# Altium project DLKU_PPK57_V2.0.PrjPcb
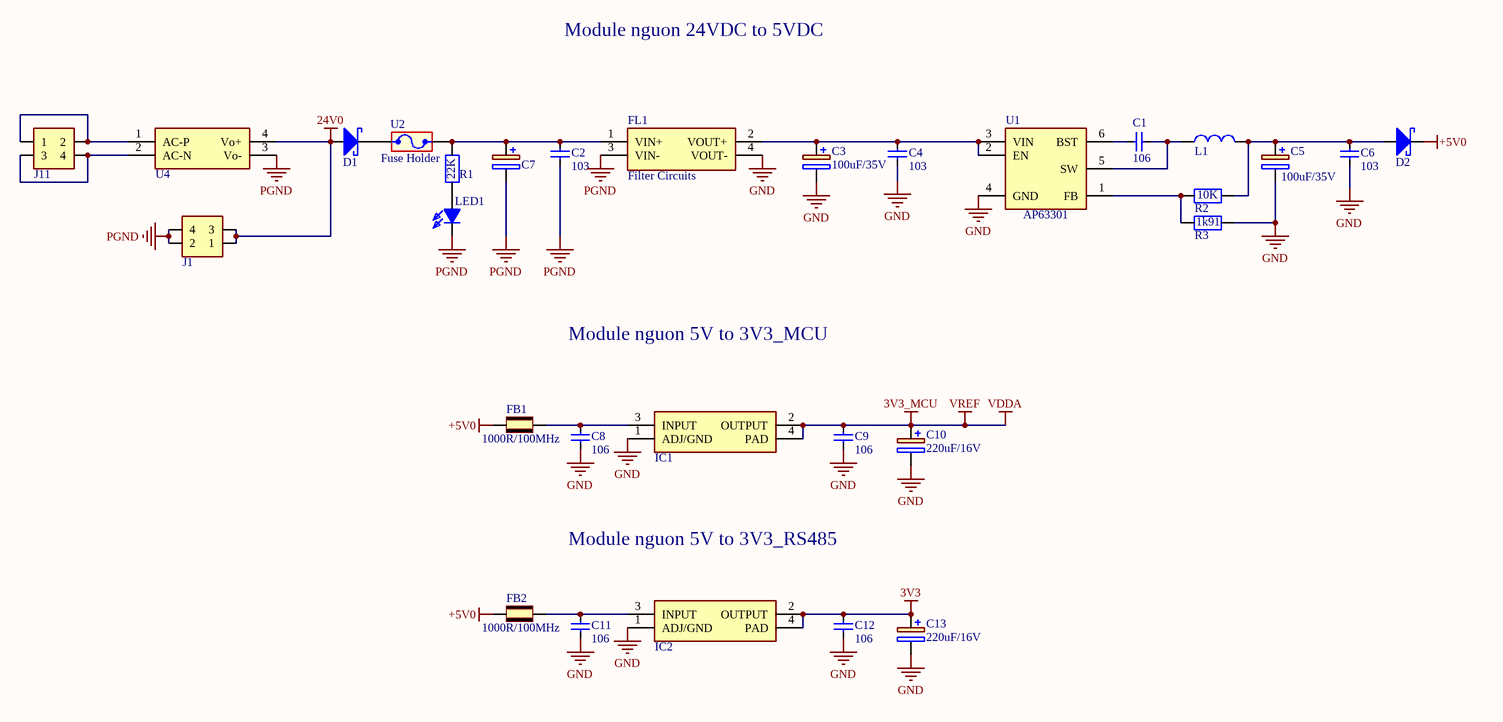
[diagram p0: Power.SchDoc]
3 sheets, 248 parts. Net scope: flat (ports and power ports of the same name join across sheets).
Board file: DLU_PPK57_V2.0.PcbDoc
Sheets:
  Power.SchDoc
  MCU.SchDoc
  Digital In-Out.SchDoc

## Sheet Power.SchDoc
size A2; SheetNumber: 1; SheetTotal: 2

### Parts
C1  106  [CAPC1608X95N]
C2  103  [CAPC1608X95N]
C3  100uF/35V  [CAPAE850X1050N]
C4  103  [CAPC1608X95N]
C5  100uF/35V  [CAPAE850X1050N]
C6  103  [CAPC1608X95N]
C7  330uF/35V  [CAPAE1000X1270N]  (value not drawn)
C8  106  [CAPC1608X95N]
C9  106  [CAPC1608X95N]
C10  220uF/16V  [CAPPM7344X430N]
C11  106  [CAPC1608X95N]
C12  106  [CAPC1608X95N]
C13  220uF/16V  [CAPPM7344X430N]
D1  40V/5A  [SODFL3517X110N]  (value not drawn)
D2  40V/5A  [SODFL3517X110N]  (value not drawn)
FB1  1000R/100MHz  [BEADC2012X110N]
FB2  1000R/100MHz  [BEADC2012X110N]
FL1  Filter Circuits  [BNX024H01K]
IC1  3V3-1A  [SOT230P700X180-4N]  (value not drawn)
IC2  3V3-1A  [SOT230P700X180-4N]  (value not drawn)
J1  Connector THD 4 position 0.165" (4.20mm)  [RHDR4W125P550X420_2X2_960X960X1310P]  (value not drawn)
J11  Connector THD 4 position 0.165" (4.20mm)  [RHDR4W125P550X420_2X2_960X960X1310P]  (value not drawn)
L1  Inductor 4.7uH/2A  [WE-PD2_453255]  (value not drawn)
LED1  LED0603_BLUE  [LEDC1608X80N]  (value not drawn)
R1  22k  [RESC1608X55N]  (value not drawn)
R2  10k  [RESC1608X55N]  (value not drawn)
R3  Res 0603 1k91  [RESC1608X55N]  (value not drawn)
U1  AP63301  [SOT95P280X100-6N]
U2  Fuse Holder  [01550900M]
U4  AC/DC CONVERTER 24V 20W  [HLK-20M24]  (value not drawn)

### Nets
3V3: C12.2 C13.1(+) IC2.2(OUTPUT) IC2.4(PAD)
3V3_MCU: C9.2 C10.1(+) IC1.2(OUTPUT) IC1.4(PAD)  [also labelled VDDA, VREF]
24V0: D1.2(A) J1.1 J1.3 U4.4(Vo+)
+5V0: D2.1(K) FB1.1 FB2.1
GND: C3.2(-) C4.1 C5.2(-) C6.1 C8.1 C9.1 C10.2(-) C11.1 C12.1 C13.2(-) FL1.4(VOUT-) IC1.1(ADJ/GND) IC2.1(ADJ/GND) R3.2 U1.4(GND)
PGND: C2.1 C7.2(-) FL1.3(VIN-) J1.2 J1.4 LED1.1(K) U4.3(Vo-)
NetC1_1: C1.1 U1.6(BST)
NetC1_2: C1.2 L1.1 U1.5(SW)
NetC2_2: C2.2 C7.1(+) FL1.1(VIN+) R1.2 U2.2
NetC3_1: C3.1(+) C4.2 FL1.2(VOUT+) U1.2(EN) U1.3(VIN)
NetC5_1: C5.1(+) C6.2 D2.2(A) L1.2 R2.2
NetC8_2: C8.2 FB1.2 IC1.3(INPUT)
NetC11_2: C11.2 FB2.2 IC2.3(INPUT)
NetD1_1: D1.1(K) U2.1
NetJ11_1: J11.1 J11.2 U4.1(AC-P)
NetJ11_3: J11.3 J11.4 U4.2(AC-N)
NetLED1_2: LED1.2(A) R1.1
NetR2_1: R2.1 R3.1 U1.1(FB)

### Notes on the sheet
- Module nguon 24VDC to 5VDC
- Module nguon 5V to 3V3_MCU
- Module nguon 5V to 3V3_RS485
- (in symbol Res 0603 1k91) 1k91
- (in symbol Res 0603 10k) 10K
- (in symbol Res 0603 22k) 22K

### Library data of the parts
C1 C8 C9 C11 C12 = Cap 106 - 0603: Cap 10uF 10v 0603 SMD 10% X7R Phycomp 10nF Multilayer Ceramic Capacitor (MLCC) 10 V dc +/-10% X7R dielectric Standard max op. temp. +125C; Manufacturer_Name: Murata Electronics; Manufacturer_Part_Number: GRM188D71A106KA73D; Datasheet Link: https://psearch.en.murata.com/capacitor/product/GRM188D71A106KA73%23.html; Height: 0.9mm; Mouser Part Number: 81-GRM188D71A106KA3D; Mouser Price/Stock: https://www.mouser.co.uk/ProductDetail/Murata-Electronics/GRM188D71A106KA73D?qs=FvQ4nYu%252B2He2GIhYKxXmMQ%3D%3D; Arrow Part Number: GRM188D71A106KA73D; Arrow Price/Stock: https://www.arrow.com/en/products/grm188d71a106ka73d/murata-manufacturing?region=nac
C2 C4 C6 = Cap 103 - 0603: Cap 10nF 50v 0603 SMD 10% X7R Phycomp 10nF Multilayer Ceramic Capacitor (MLCC) 50 V dc +/-10% X7R dielectric Standard max op. temp. +125C; Manufacturer_Name: KEMET; Manufacturer_Part_Number: CC0603KRX7R9BB103; Datasheet Link: https://datasheet.datasheetarchive.com/originals/distributors/Datasheets_SAMA/d9f127a4875522309d99aa7dec79633c.pdf; Height: 0.9mm; Mouser Part Number: 603-CC603KRX7R9BB103; Mouser Price/Stock: https://www.mouser.co.uk/ProductDetail/YAGEO/CC0603KRX7R9BB103?qs=AgBp2OyFlx%252BeoRRspw6PJg%3D%3D; Arrow Part Number: CC0603KRX7R9BB103; Arrow Price/Stock: https://www.arrow.com/en/products/cc0603krx7r9bb103/yageo?region=nac
C3 C5 = Cap smd 100uF/35V: Aluminium Electrolytic Capacitors - SMD 100UF 35V 105C 2500H; Manufacturer_Name: Vishay; Manufacturer_Part_Number: MAL215097011E3; Datasheet Link: http://www.vishay.com/docs/28395/150crz.pdf; Height: 10.5mm; Mouser Part Number: 594-MAL215097011E3; Mouser Price/Stock: https://www.mouser.co.uk/ProductDetail/Vishay-BC-Components/MAL215097011E3?qs=qmStTZH4TzmmMfVG5I6TQQ%3D%3D; Arrow Part Number: MAL215097011E3; Arrow Price/Stock: https://www.arrow.com/en/products/mal215097011e3/vishay
C7 = Cap smd 330uF/35V: Aluminum Organic Polymer Capacitors 35Vol 330uF SMD 2KHr ESR=22 mOhms AECQ200; Manufacturer_Name: KEMET; Manufacturer_Part_Number: A768MS337M1VLAS022; Datasheet Link: https://search.kemet.com/component-documentation/download/specsheet/A768MS337M1VLAS022; Height: 12.7mm; Mouser Part Number: 80-A768MS337M1VLAS22; Mouser Price/Stock: https://www.mouser.co.uk/ProductDetail/KEMET/A768MS337M1VLAS022?qs=sPbYRqrBIVliRmrbB6XsUw%3D%3D; Arrow Part Number: A768MS337M1VLAS022; Arrow Price/Stock: https://www.arrow.com/en/products/a768ms337m1vlas022/kemet-corporation?region=nac
C10 C13 = Cap smd 220uF/16V: Tantalum Capacitors - Solid SMD 16V 220uF 10% 2917 Multi-anode; Manufacturer_Name: Kyocera AVX; Manufacturer_Part_Number: TPME227K016R0025; Datasheet Link: http://datasheets.avx.com/TPM.pdf; Height: 4.3mm; Mouser Part Number: 581-TPME227K016R0025; Mouser Price/Stock: https://www.mouser.com/Search/Refine.aspx?Keyword=581-TPME227K016R0025
D1 D2 = Diode 40V/5A: DIODE SCHOTTKY 40V 5A SMA; Manufacturer_Name: Nexperia; Manufacturer_Part_Number: PMEG40T30ERX; Datasheet Link: https://assets.nexperia.com/documents/data-sheet/PMEG40T30ER.pdf; Height: 1.1mm; Mouser Part Number: 771-PMEG40T30ERX; Mouser Price/Stock: https://www.mouser.co.uk/ProductDetail/Nexperia/PMEG40T30ERX?qs=1mbolxNpo8eeG%2Fr5KLvXLA%3D%3D; Arrow Part Number: PMEG40T30ERX; Arrow Price/Stock: https://www.arrow.com/en/products/pmeg40t30erx/nexperia?region=europe
FB1 FB2 = Ferrite Bead 1000R 100MHz: Ferrite Beads 1000ohms 100MHz 1A Monolithic 0805 SMD; Manufacturer_Name: Laird-Signal Integrity Products; Manufacturer_Part_Number: MI0805J102R-10; Datasheet Link: https://www.laird.com/sites/default/files/mi0805j102r-10-datasheet.pdf; Height: 1.1mm
FL1 = Filter: EMI Filter Circuits 10.0 UF 50V 20A; Manufacturer_Name: Murata Electronics; Manufacturer_Part_Number: BNX026H01L; Datasheet Link: https://www.murata.com/en-us/products/productdetail?partno=BNX026H01%23; Height: 3.7mm; Mouser Part Number: 81-BNX026H01L; Mouser Price/Stock: https://www.mouser.co.uk/ProductDetail/Murata-Electronics/BNX026H01L?qs=zU3EaVYbc3y78A%2FfsSIPhQ%3D%3D; Arrow Part Number: BNX026H01L; Arrow Price/Stock: https://www.arrow.com/en/products/bnx026h01l/murata-manufacturing?utm_currency=USD&region=nac
IC1 IC2 = AMS1117-3V3: LDO Voltage Regulators 800MA LDO LINEAR REG A 926-LM1117IMP3.3NOPB; Manufacturer_Name: Texas Instruments; Manufacturer_Part_Number: LM1117IMPX3.3/NOPB; Datasheet Link: http://www.ti.com/lit/ds/symlink/lm1117.pdf; Height: 1.8mm
J1 J11 = Connector 2x2: Connector Header Through Hole 4 position 0.165" (4.20mm); Manufacturer_Name: Molex; Manufacturer_Part_Number: 0039281043; Datasheet Link: https://www.molex.com/pdm_docs/sd/039281043_sd.pdf; Height: 13.1mm; Mouser Part Number: N/A; Mouser Price/Stock: https://www.mouser.co.uk/ProductDetail/Molex/0039281043?qs=PBcRNPEHKsoXjYsIax3FJA%3D%3D; Arrow Part Number: 0039281043; Arrow Price/Stock: https://www.arrow.com/en/products/0039281043/molex?utm_currency=USD&region=nac
L1 = Inductor 4.7uH/2A: Power Inductors - SMD WE-PD2 4532 4.7uH 1.82A .11Ohm; Manufacturer_Name: Wurth Elektronik; Manufacturer_Part_Number: 744773047; Mouser Part Number: 710-744773047; Mouser Price/Stock: https://www.mouser.co.uk/ProductDetail/Wurth-Elektronik/744773047?qs=rS3zZhy2AQMDGJWCDZKEvg%3D%3D
LED1 = LED0603_BLUE: LED; Manufacturer_Name: Wurth Elektronik; Manufacturer_Part_Number: 150060BS75000; Datasheet Link: https://componentsearchengine.com/Datasheets/2/150060BS75000.pdf; Height: 0.8mm; Mouser Part Number: 710-150060BS75000; Mouser Price/Stock: https://www.mouser.co.uk/ProductDetail/Wurth-Elektronik/150060BS75000?qs=LlUlMxKIyB2DLLpXQThavA%3D%3D
R1 = Res 0603 22k: Thick Film Resistors - SMD 22 kOhms 100mW 0603 1%; Manufacturer_Name: Panasonic; Manufacturer_Part_Number: ERJ-UP3J223V; Datasheet Link: https://industrial.panasonic.com/cdbs/www-data/pdf/RDP0000/AOA0000C337.pdf; Height: 0.55mm; Mouser Part Number: 667-ERJ-UP3J223V; Mouser Price/Stock: https://www.mouser.co.uk/ProductDetail/Panasonic/ERJ-UP3J223V?qs=GedFDFLaBXHkpI8RZhFc4A%3D%3D
R2 = Res 0603 10k: Resistor 10 kOhms ±1% 0.1W, 1/10W Chip Resistor 0603 (1608 Metric) Automotive AEC-Q200 Thick Film; Manufacturer_Name: Panasonic; Manufacturer_Part_Number: ERJ-3EKF1002V; Datasheet Link: http://industrial.panasonic.com/cdbs/www-data/pdf/RDA0000/AOA0000C86.pdf; Height: 0.55mm; Mouser Part Number: 667-ERJ-3EKF1002V; Mouser Price/Stock: https://www.mouser.co.uk/ProductDetail/Panasonic/ERJ-3EKF1002V?qs=H7k1u0Mp9JSrGPQ5%2F5COuw%3D%3D; Arrow Part Number: ERJ-3EKF1002V; Arrow Price/Stock: https://www.arrow.com/en/products/erj-3ekf1002v/panasonic?region=europe
R3 = Res 0603 1k91: Thick Film Resistors - SMD 1.91K 1% 1/10W; Manufacturer_Name: Bourns; Manufacturer_Part_Number: CR0603-FX-1911ELF; Datasheet Link: https://www.bourns.com/pdfs/chpreztr.pdf; Height: 0.55mm; Mouser Part Number: 652-CR0603FX-1911ELF; Mouser Price/Stock: https://www.mouser.com/Search/Refine.aspx?Keyword=652-CR0603FX-1911ELF
U1 = AP63301: Switching Voltage Regulators DCDC Conv HV Buck TSOT26 T&R 3K; Manufacturer_Name: Diodes Incorporated; Manufacturer_Part_Number: AP63301WU-7; Datasheet Link: https://www.diodes.com//assets/Datasheets/AP63300-AP63301.pdf; Height: 1mm; Mouser Part Number: 621-AP63301WU-7; Mouser Price/Stock: https://www.mouser.co.uk/ProductDetail/Diodes-Incorporated/AP63301WU-7?qs=bZr6mbWTK5mxozg17S0lNg%3D%3D; Arrow Part Number: AP63301WU-7; Arrow Price/Stock: https://www.arrow.com/en/products/ap63301wu-7/diodes-incorporated?region=nac
U2 = Fuse Holder: Fuse Holder ACS NANO HLDR; Manufacturer_Name: LITTELFUSE; Datasheet Link: http://www.littelfuse.com/~/media/electronics/datasheets/fuses/littelfuse_fuse_154_154t_154l_154tl_datasheet.pdf.pdf; Height: 3.81mm; Manufacturer_Part_Number: 01550900M; Mouser Part Number: 576-01550900M; Mouser Price/Stock: https://www.mouser.co.uk/ProductDetail/Littelfuse/01550900M?qs=DDoybve0rC%252BTXq1hqi5X1g%3D%3D; Arrow Part Number: 01550900M; Arrow Price/Stock: https://www.arrow.com/en/products/01550900m/littelfuse?utm_currency=USD&region=europe
U4 = HLK-20M24: AC/DC CONVERTER 24V 20WEnclosed AC DC Converters 1 Output 24V 830mA 85 ~ 264 VAC, 120 ~ 370 VDC Input

## Sheet MCU.SchDoc
size A2
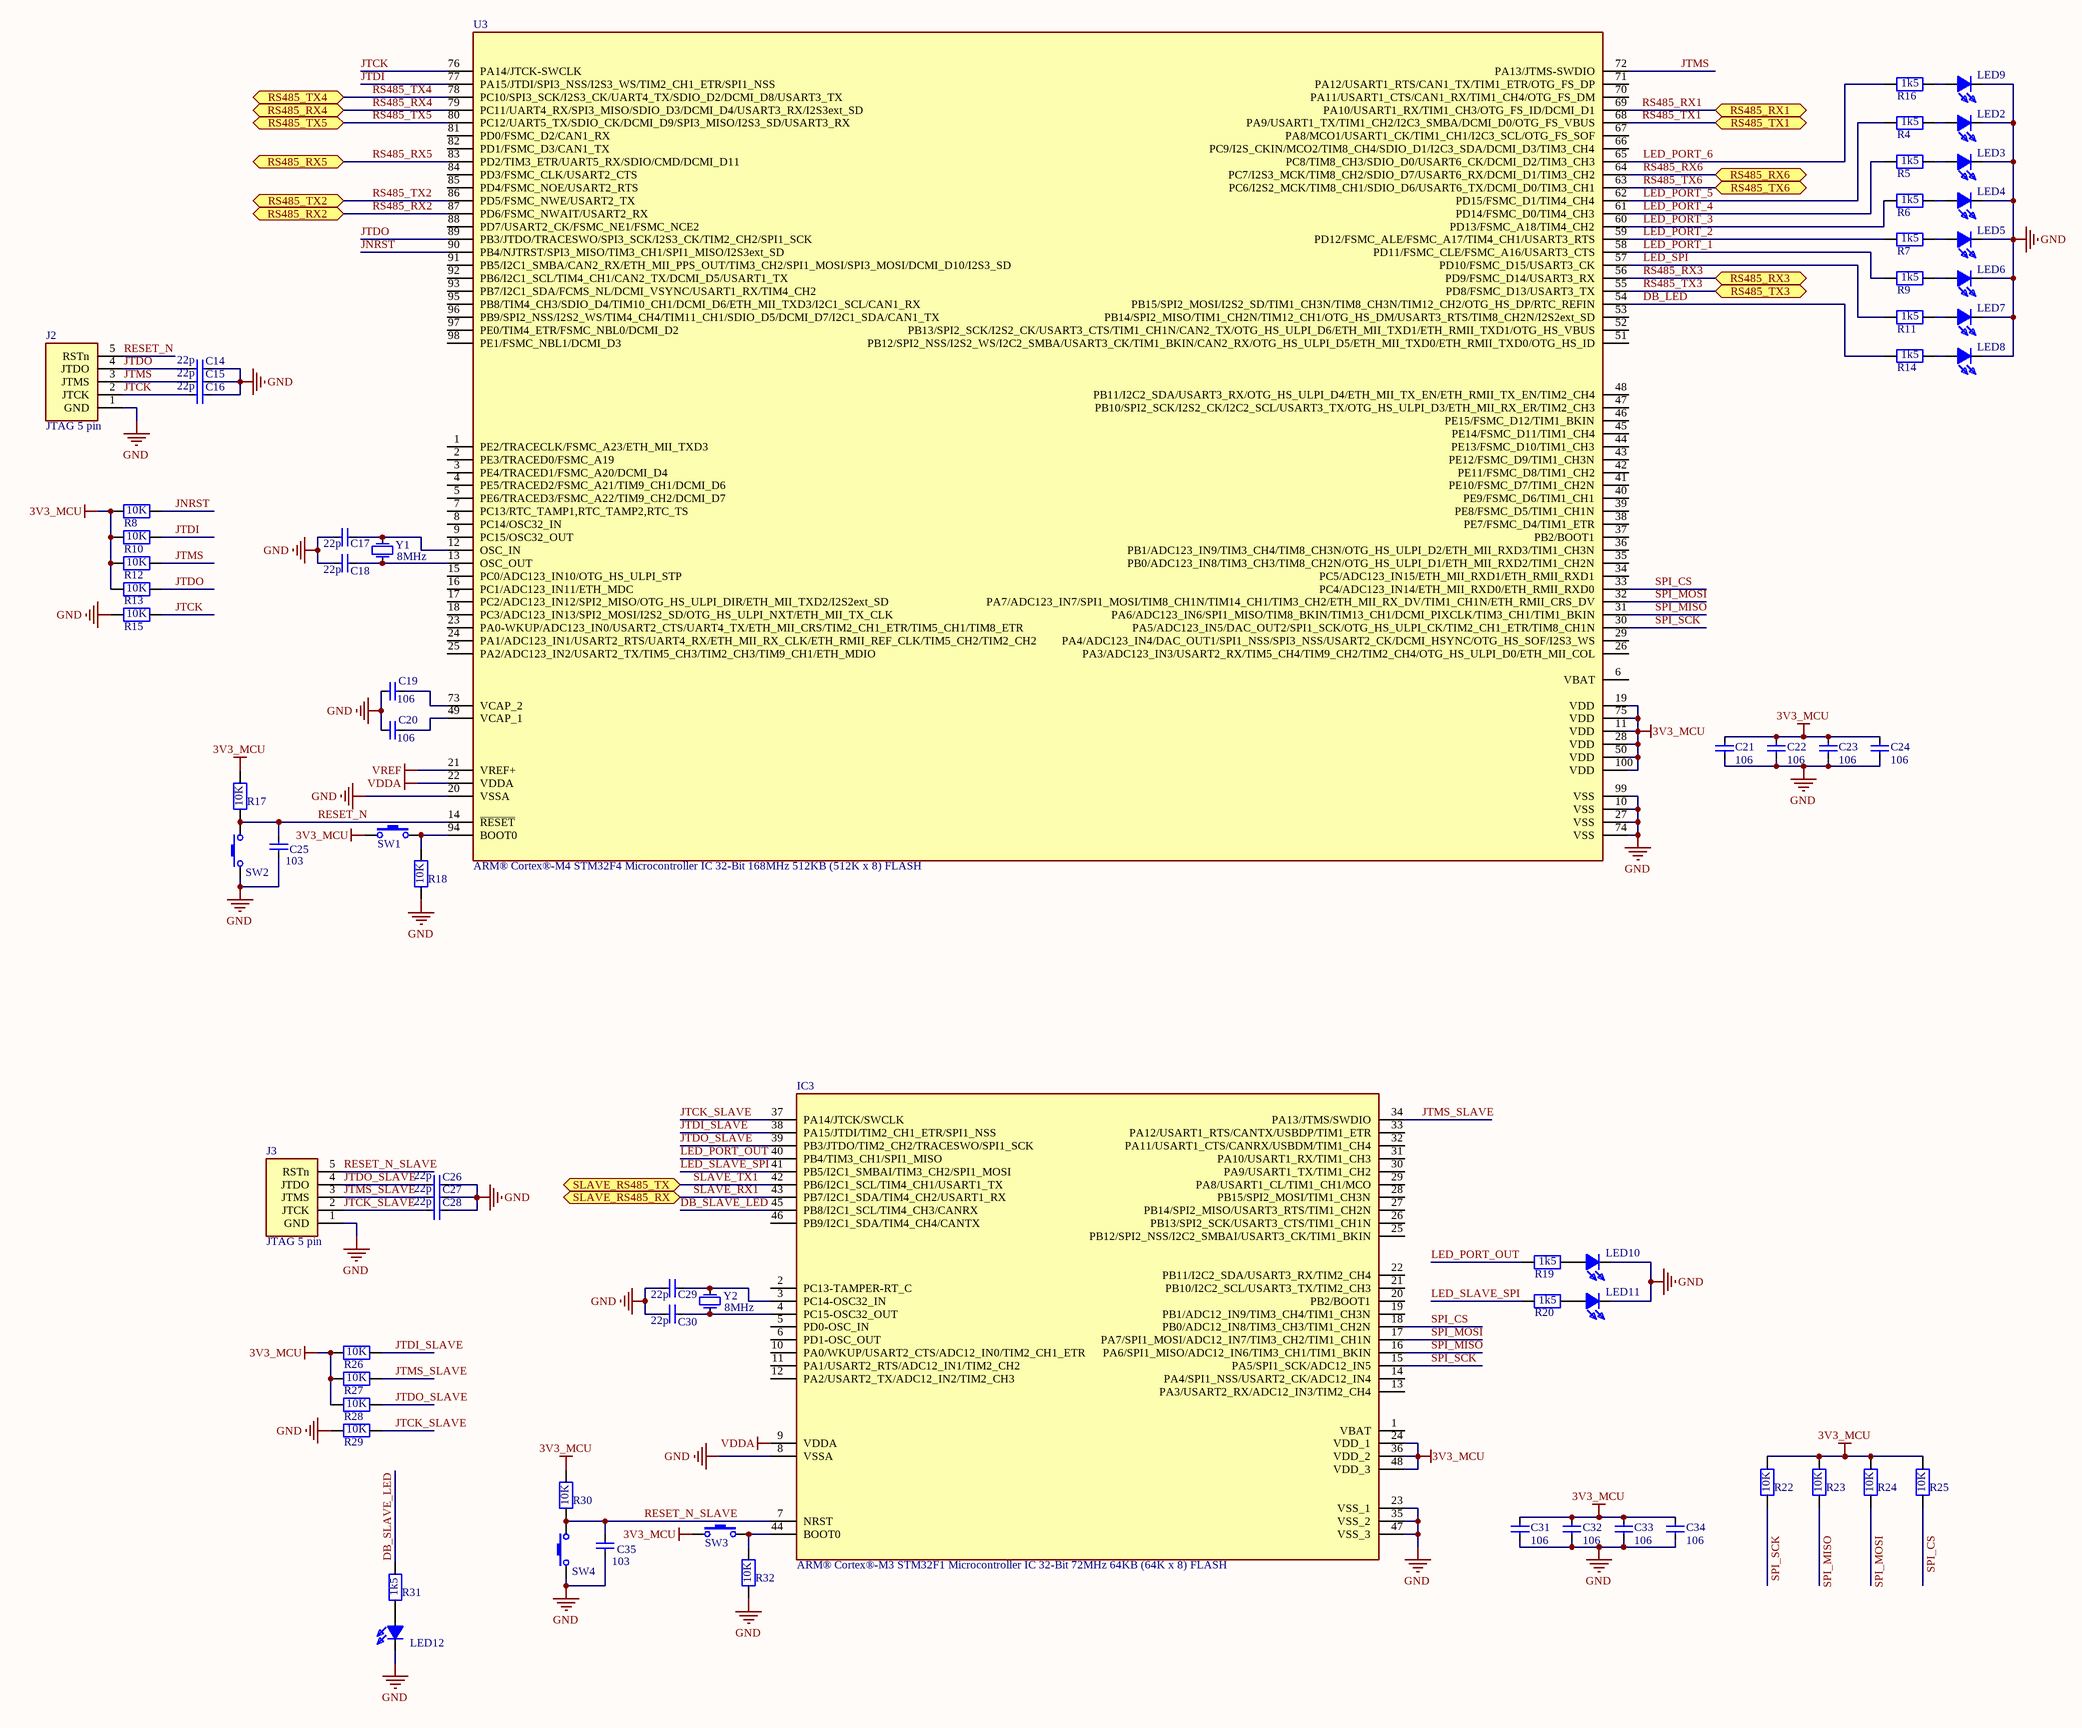
[diagram p1: MCU.SchDoc]

### Parts
C14  22p  [CAPC1608X95N]
C15  22p  [CAPC1608X95N]
C16  22p  [CAPC1608X95N]
C17  22p  [CAPC1608X95N]
C18  22p  [CAPC1608X95N]
C19  106  [CAPC1608X95N]
C20  106  [CAPC1608X95N]
C21  106  [CAPC1608X95N]
C22  106  [CAPC1608X95N]
C23  106  [CAPC1608X95N]
C24  106  [CAPC1608X95N]
C25  103  [CAPC1608X95N]
C26  22p  [CAPC1608X95N]
C27  22p  [CAPC1608X95N]
C28  22p  [CAPC1608X95N]
C29  22p  [CAPC1608X95N]
C30  22p  [CAPC1608X95N]
C31  106  [CAPC1608X95N]
C32  106  [CAPC1608X95N]
C33  106  [CAPC1608X95N]
C34  106  [CAPC1608X95N]
C35  103  [CAPC1608X95N]
IC3  ARM® Cortex®-M3 STM32F1 Microcontroller IC 32-Bit 72MHz 64KB (64K x 8) FLASH  [QFP50P900X900X160-48N]
J2  JTAG 5 pin  [HDRV5W66P0X254_1X5_1270X249X1067P]
J3  JTAG 5 pin  [HDRV5W66P0X254_1X5_1270X249X1067P]
LED2  LED0603_BLUE  [LEDC1608X80N]  (value not drawn)
LED3  LED0603_BLUE  [LEDC1608X80N]  (value not drawn)
LED4  LED0603_BLUE  [LEDC1608X80N]  (value not drawn)
LED5  LED0603_BLUE  [LEDC1608X80N]  (value not drawn)
LED6  LED0603_BLUE  [LEDC1608X80N]  (value not drawn)
LED7  LED0603_BLUE  [LEDC1608X80N]  (value not drawn)
LED8  LED0603_BLUE  [LEDC1608X80N]  (value not drawn)
LED9  LED0603_BLUE  [LEDC1608X80N]  (value not drawn)
LED10  LED0603_BLUE  [LEDC1608X80N]  (value not drawn)
LED11  LED0603_BLUE  [LEDC1608X80N]  (value not drawn)
LED12  LED0603_BLUE  [LEDC1608X80N]  (value not drawn)
R4  Res 0603 1k5  [RESC1608X55N]  (value not drawn)
R5  Res 0603 1k5  [RESC1608X55N]  (value not drawn)
R6  Res 0603 1k5  [RESC1608X55N]  (value not drawn)
R7  Res 0603 1k5  [RESC1608X55N]  (value not drawn)
R8  10k  [RESC1608X55N]  (value not drawn)
R9  Res 0603 1k5  [RESC1608X55N]  (value not drawn)
R10  10k  [RESC1608X55N]  (value not drawn)
R11  Res 0603 1k5  [RESC1608X55N]  (value not drawn)
R12  10k  [RESC1608X55N]  (value not drawn)
R13  10k  [RESC1608X55N]  (value not drawn)
R14  Res 0603 1k5  [RESC1608X55N]  (value not drawn)
R15  10k  [RESC1608X55N]  (value not drawn)
R16  Res 0603 1k5  [RESC1608X55N]  (value not drawn)
R17  10k  [RESC1608X55N]  (value not drawn)
R18  10k  [RESC1608X55N]  (value not drawn)
R19  Res 0603 1k5  [RESC1608X55N]  (value not drawn)
R20  Res 0603 1k5  [RESC1608X55N]  (value not drawn)
R22  10k  [RESC1608X55N]  (value not drawn)
R23  10k  [RESC1608X55N]  (value not drawn)
R24  10k  [RESC1608X55N]  (value not drawn)
R25  10k  [RESC1608X55N]  (value not drawn)
R26  10k  [RESC1608X55N]  (value not drawn)
R27  10k  [RESC1608X55N]  (value not drawn)
R28  10k  [RESC1608X55N]  (value not drawn)
R29  10k  [RESC1608X55N]  (value not drawn)
R30  10k  [RESC1608X55N]  (value not drawn)
R31  Res 0603 1k5  [RESC1608X55N]  (value not drawn)
R32  10k  [RESC1608X55N]  (value not drawn)
SW1  Switch SMD 2 pin  [RS282G05A3SMRT]  (value not drawn)
SW2  Switch SMD 2 pin  [RS282G05A3SMRT]  (value not drawn)
SW3  Switch SMD 2 pin  [RS282G05A3SMRT]  (value not drawn)
SW4  Switch SMD 2 pin  [RS282G05A3SMRT]  (value not drawn)
U3  ARM® Cortex®-M4 STM32F4 Microcontroller IC 32-Bit 168MHz 512KB (512K x 8) FLASH  [QFP50P1600X1600X160-100N]
Y1  8MHz  [F90800018Q]
Y2  8MHz  [F90800018Q]

### Ports
RS485_RX1 (bidir), RS485_RX2 (bidir), RS485_RX3 (bidir), RS485_RX4 (bidir), RS485_RX5 (bidir), RS485_RX6 (bidir), RS485_TX1 (bidir), RS485_TX2 (bidir), RS485_TX3 (bidir), RS485_TX4 (bidir), RS485_TX5 (bidir), RS485_TX6 (bidir), SLAVE_RS485_RX (bidir), SLAVE_RS485_TX (bidir)

### Nets
3V3_MCU: C21.2 C22.2 C23.2 C24.2 C31.2 C32.2 C33.2 C34.2 IC3.9(VDDA) IC3.24(VDD_1) IC3.36(VDD_2) IC3.48(VDD_3) R8.1 R10.1 R12.1 R13.1 R17.2 R22.2 R23.2 R24.2 R25.2 R26.1 R27.1 R28.1 R30.2 SW1.P1(COM1) SW3.P1(COM1) U3.11(VDD) U3.19(VDD) U3.21(VREF+) U3.22(VDDA) U3.28(VDD) U3.50(VDD) U3.75(VDD) U3.100(VDD)  [also labelled VDDA, VREF]
GND: C14.2 C15.2 C16.2 C17.1 C18.1 C19.1 C20.1 C21.1 C22.1 C23.1 C24.1 C25.1 C26.2 C27.2 C28.2 C29.1 C30.1 C31.1 C32.1 C33.1 C34.1 C35.1 IC3.8(VSSA) IC3.23(VSS_1) IC3.35(VSS_2) IC3.47(VSS_3) J2.1(GND) J3.1(GND) LED2.1(K) LED3.1(K) LED4.1(K) LED5.1(K) LED6.1(K) LED7.1(K) LED8.1(K) LED9.1(K) LED10.1(K) LED11.1(K) LED12.1(K) R15.1 R18.1 R29.1 R32.1 SW2.P1(COM1) SW4.P1(COM1) U3.10(VSS) U3.20(VSSA) U3.27(VSS) U3.74(VSS) U3.99(VSS)
DB_LED: R14.1 U3.54(PB15/SPI2_MOSI/I2S2_SD/TIM1_CH3N/TIM8_CH3N/TIM12_CH2/OTG_HS_DP/RTC_REFIN)
DB_SLAVE_LED: IC3.45(PB8/I2C1_SCL/TIM4_CH3/CANRX) R31.2
JNRST: R8.2 U3.90(PB4/NJTRST/SPI3_MISO/TIM3_CH1/SPI1_MISO/I2S3ext_SD)
JTCK: C16.1 J2.2(JTCK) R15.2 U3.76(PA14/JTCK-SWCLK)
JTCK_SLAVE: C28.1 IC3.37(PA14/JTCK/SWCLK) J3.2(JTCK) R29.2
JTDI: R10.2 U3.77(PA15/JTDI/SPI3_NSS/I2S3_WS/TIM2_CH1_ETR/SPI1_NSS)
JTDI_SLAVE: IC3.38(PA15/JTDI/TIM2_CH1_ETR/SPI1_NSS) R26.2
JTDO: C14.1 J2.4(JTDO) R13.2 U3.89(PB3/JTDO/TRACESWO/SPI3_SCK/I2S3_CK/TIM2_CH2/SPI1_SCK)
JTDO_SLAVE: C26.1 IC3.39(PB3/JTDO/TIM2_CH2/TRACESWO/SPI1_SCK) J3.4(JTDO) R28.2
JTMS: C15.1 J2.3(JTMS) R12.2 U3.72(PA13/JTMS-SWDIO)
JTMS_SLAVE: C27.1 IC3.34(PA13/JTMS/SWDIO) J3.3(JTMS) R27.2
LED_PORT_1: R9.1 U3.58(PD11/FSMC_CLE/FSMC_A16/USART3_CTS)
LED_PORT_2: R7.1 U3.59(PD12/FSMC_ALE/FSMC_A17/TIM4_CH1/USART3_RTS)
LED_PORT_3: R6.1 U3.60(PD13/FSMC_A18/TIM4_CH2)
LED_PORT_4: R5.1 U3.61(PD14/FSMC_D0/TIM4_CH3)
LED_PORT_5: R4.1 U3.62(PD15/FSMC_D1/TIM4_CH4)
LED_PORT_6: R16.1 U3.65(PC8/TIM8_CH3/SDIO_D0/USART6_CK/DCMI_D2/TIM3_CH3)
LED_PORT_OUT: IC3.40(PB4/TIM3_CH1/SPI1_MISO) R19.1
LED_SLAVE_SPI: IC3.41(PB5/I2C1_SMBAI/TIM3_CH2/SPI1_MOSI) R20.1
LED_SPI: R11.1 U3.57(PD10/FSMC_D15/USART3_CK)
RESET_N: C25.2 J2.5(RSTn) R17.1 SW2.T1(COM2) U3.14(~{RESET})
RESET_N_SLAVE: C35.2 IC3.7(NRST) J3.5(RSTn) R30.1 SW4.T1(COM2)
RS485_RX1: U3.69(PA10/USART1_RX/TIM1_CH3/OTG_FS_ID/DCMI_D1) ; port RS485_RX1
RS485_RX2: U3.87(PD6/FSMC_NWAIT/USART2_RX) ; port RS485_RX2
RS485_RX3: U3.56(PD9/FSMC_D14/USART3_RX) ; port RS485_RX3
RS485_RX4: U3.79(PC11/UART4_RX/SPI3_MISO/SDIO_D3/DCMI_D4/USART3_RX/I2S3ext_SD) ; port RS485_RX4
RS485_RX5: U3.83(PD2/TIM3_ETR/UART5_RX/SDIO/CMD/DCMI_D11) ; port RS485_RX5
RS485_RX6: U3.64(PC7/I2S3_MCK/TIM8_CH2/SDIO_D7/USART6_RX/DCMI_D1/TIM3_CH2) ; port RS485_RX6
RS485_TX1: U3.68(PA9/USART1_TX/TIM1_CH2/I2C3_SMBA/DCMI_D0/OTG_FS_VBUS) ; port RS485_TX1
RS485_TX2: U3.86(PD5/FSMC_NWE/USART2_TX) ; port RS485_TX2
RS485_TX3: U3.55(PD8/FSMC_D13/USART3_TX) ; port RS485_TX3
RS485_TX4: U3.78(PC10/SPI3_SCK/I2S3_CK/UART4_TX/SDIO_D2/DCMI_D8/USART3_TX) ; port RS485_TX4
RS485_TX5: U3.80(PC12/UART5_TX/SDIO_CK/DCMI_D9/SPI3_MISO/I2S3_SD/USART3_RX) ; port RS485_TX5
RS485_TX6: U3.63(PC6/I2S2_MCK/TIM8_CH1/SDIO_D6/USART6_TX/DCMI_D0/TIM3_CH1) ; port RS485_TX6
SLAVE_RX1: IC3.43(PB7/I2C1_SDA/TIM4_CH2/USART1_RX) ; port SLAVE_RS485_RX
SLAVE_TX1: IC3.42(PB6/I2C1_SCL/TIM4_CH1/USART1_TX) ; port SLAVE_RS485_TX
SPI_CS: IC3.18(PB0/ADC12_IN8/TIM3_CH3/TIM1_CH2N) R25.1 U3.33(PC4/ADC123_IN14/ETH_MII_RXD0/ETH_RMII_RXD0)
SPI_MISO: IC3.16(PA6/SPI1_MISO/ADC12_IN6/TIM3_CH1/TIM1_BKIN) R23.1 U3.31(PA6/ADC123_IN6/SPI1_MISO/TIM8_BKIN/TIM13_CH1/DCMI_PIXCLK/TIM3_CH1/TIM1_BKIN)
SPI_MOSI: IC3.17(PA7/SPI1_MOSI/ADC12_IN7/TIM3_CH2/TIM1_CH1N) R24.1 U3.32(PA7/ADC123_IN7/SPI1_MOSI/TIM8_CH1N/TIM14_CH1/TIM3_CH2/ETH_MII_RX_DV/TIM1_CH1N/ETH_RMII_CRS_DV)
SPI_SCK: IC3.15(PA5/SPI1_SCK/ADC12_IN5) R22.1 U3.30(PA5/ADC123_IN5/DAC_OUT2/SPI1_SCK/OTG_HS_ULPI_CK/TIM2_CH1_ETR/TIM8_CH1N)
NetC17_2: C17.2 U3.12(OSC_IN) Y1.1(CRYSTAL_1)
NetC18_2: C18.2 U3.13(OSC_OUT) Y1.2(CRYSTAL_2)
NetC19_2: C19.2 U3.73(VCAP_2)
NetC20_2: C20.2 U3.49(VCAP_1)
NetC29_2: C29.2 IC3.3(PC14-OSC32_IN) Y2.1(CRYSTAL_1)
NetC30_2: C30.2 IC3.4(PC15-OSC32_OUT) Y2.2(CRYSTAL_2)
NetIC3_44: IC3.44(BOOT0) R32.2 SW3.T1(COM2)
NetLED2_2: LED2.2(A) R4.2
NetLED3_2: LED3.2(A) R5.2
NetLED4_2: LED4.2(A) R6.2
NetLED5_2: LED5.2(A) R7.2
NetLED6_2: LED6.2(A) R9.2
NetLED7_2: LED7.2(A) R11.2
NetLED8_2: LED8.2(A) R14.2
NetLED9_2: LED9.2(A) R16.2
NetLED10_2: LED10.2(A) R19.2
NetLED11_2: LED11.2(A) R20.2
NetLED12_2: LED12.2(A) R31.1
NetR18_2: R18.2 SW1.T1(COM2) U3.94(BOOT0)

Not connected (* = marked no-connect by the designer): IC3 1(VBAT) 2(PC13-TAMPER-RT_C) 5(PD0-OSC_IN) 6(PD1-OSC_OUT) 10(PA0/WKUP/USART2_CTS/ADC12_IN0/TIM2_CH1_ETR) 11(PA1/USART2_RTS/ADC12_IN1/TIM2_CH2) 12(PA2/USART2_TX/ADC12_IN2/TIM2_CH3) 13(PA3/USART2_RX/ADC12_IN3/TIM2_CH4) 14(PA4/SPI1_NSS/USART2_CK/ADC12_IN4) 19(PB1/ADC12_IN9/TIM3_CH4/TIM1_CH3N) 20(PB2/BOOT1) 21(PB10/I2C2_SCL/USART3_TX/TIM2_CH3) 22(PB11/I2C2_SDA/USART3_RX/TIM2_CH4) 25(PB12/SPI2_NSS/I2C2_SMBAI/USART3_CK/TIM1_BKIN) 26(PB13/SPI2_SCK/USART3_CTS/TIM1_CH1N) 27(PB14/SPI2_MISO/USART3_RTS/TIM1_CH2N) 28(PB15/SPI2_MOSI/TIM1_CH3N) 29(PA8/USART1_CL/TIM1_CH1/MCO) 30(PA9/USART1_TX/TIM1_CH2) 31(PA10/USART1_RX/TIM1_CH3) 32(PA11/USART1_CTS/CANRX/USBDM/TIM1_CH4) 33(PA12/USART1_RTS/CANTX/USBDP/TIM1_ETR) 46(PB9/I2C1_SDA/TIM4_CH4/CANTX); U3 1(PE2/TRACECLK/FSMC_A23/ETH_MII_TXD3) 2(PE3/TRACED0/FSMC_A19) 3(PE4/TRACED1/FSMC_A20/DCMI_D4) 4(PE5/TRACED2/FSMC_A21/TIM9_CH1/DCMI_D6) 5(PE6/TRACED3/FSMC_A22/TIM9_CH2/DCMI_D7) 6(VBAT) 7(PC13/RTC_TAMP1,RTC_TAMP2,RTC_TS) 8(PC14/OSC32_IN) 9(PC15/OSC32_OUT) 15(PC0/ADC123_IN10/OTG_HS_ULPI_STP) 16(PC1/ADC123_IN11/ETH_MDC) 17(PC2/ADC123_IN12/SPI2_MISO/OTG_HS_ULPI_DIR/ETH_MII_TXD2/I2S2ext_SD) 18(PC3/ADC123_IN13/SPI2_MOSI/I2S2_SD/OTG_HS_ULPI_NXT/ETH_MII_TX_CLK) 23(PA0-WKUP/ADC123_IN0/USART2_CTS/UART4_TX/ETH_MII_CRS/TIM2_CH1_ETR/TIM5_CH1/TIM8_ETR) 24(PA1/ADC123_IN1/USART2_RTS/UART4_RX/ETH_MII_RX_CLK/ETH_RMII_REF_CLK/TIM5_CH2/TIM2_CH2) 25(PA2/ADC123_IN2/USART2_TX/TIM5_CH3/TIM2_CH3/TIM9_CH1/ETH_MDIO) 26(PA3/ADC123_IN3/USART2_RX/TIM5_CH4/TIM9_CH2/TIM2_CH4/OTG_HS_ULPI_D0/ETH_MII_COL) 29(PA4/ADC123_IN4/DAC_OUT1/SPI1_NSS/SPI3_NSS/USART2_CK/DCMI_HSYNC/OTG_HS_SOF/I2S3_WS) 34(PC5/ADC123_IN15/ETH_MII_RXD1/ETH_RMII_RXD1) 35(PB0/ADC123_IN8/TIM3_CH3/TIM8_CH2N/OTG_HS_ULPI_D1/ETH_MII_RXD2/TIM1_CH2N) 36(PB1/ADC123_IN9/TIM3_CH4/TIM8_CH3N/OTG_HS_ULPI_D2/ETH_MII_RXD3/TIM1_CH3N) 37(PB2/BOOT1) 38(PE7/FSMC_D4/TIM1_ETR) 39(PE8/FSMC_D5/TIM1_CH1N) 40(PE9/FSMC_D6/TIM1_CH1) 41(PE10/FSMC_D7/TIM1_CH2N) 42(PE11/FSMC_D8/TIM1_CH2) 43(PE12/FSMC_D9/TIM1_CH3N) 44(PE13/FSMC_D10/TIM1_CH3) 45(PE14/FSMC_D11/TIM1_CH4) 46(PE15/FSMC_D12/TIM1_BKIN) 47(PB10/SPI2_SCK/I2S2_CK/I2C2_SCL/USART3_TX/OTG_HS_ULPI_D3/ETH_MII_RX_ER/TIM2_CH3) 48(PB11/I2C2_SDA/USART3_RX/OTG_HS_ULPI_D4/ETH_MII_TX_EN/ETH_RMII_TX_EN/TIM2_CH4) 51(PB12/SPI2_NSS/I2S2_WS/I2C2_SMBA/USART3_CK/TIM1_BKIN/CAN2_RX/OTG_HS_ULPI_D5/ETH_MII_TXD0/ETH_RMII_TXD0/OTG_HS_ID) 52(PB13/SPI2_SCK/I2S2_CK/USART3_CTS/TIM1_CH1N/CAN2_TX/OTG_HS_ULPI_D6/ETH_MII_TXD1/ETH_RMII_TXD1/OTG_HS_VBUS) 53(PB14/SPI2_MISO/TIM1_CH2N/TIM12_CH1/OTG_HS_DM/USART3_RTS/TIM8_CH2N/I2S2ext_SD) 66(PC9/I2S_CKIN/MCO2/TIM8_CH4/SDIO_D1/I2C3_SDA/DCMI_D3/TIM3_CH4) 67(PA8/MCO1/USART1_CK/TIM1_CH1/I2C3_SCL/OTG_FS_SOF) 70(PA11/USART1_CTS/CAN1_RX/TIM1_CH4/OTG_FS_DM) 71(PA12/USART1_RTS/CAN1_TX/TIM1_ETR/OTG_FS_DP) 81(PD0/FSMC_D2/CAN1_RX) 82(PD1/FSMC_D3/CAN1_TX) 84(PD3/FSMC_CLK/USART2_CTS) 85(PD4/FSMC_NOE/USART2_RTS) 88(PD7/USART2_CK/FSMC_NE1/FSMC_NCE2) 91(PB5/I2C1_SMBA/CAN2_RX/ETH_MII_PPS_OUT/TIM3_CH2/SPI1_MOSI/SPI3_MOSI/DCMI_D10/I2S3_SD) 92(PB6/I2C1_SCL/TIM4_CH1/CAN2_TX/DCMI_D5/USART1_TX) 93(PB7/I2C1_SDA/FCMS_NL/DCMI_VSYNC/USART1_RX/TIM4_CH2) 95(PB8/TIM4_CH3/SDIO_D4/TIM10_CH1/DCMI_D6/ETH_MII_TXD3/I2C1_SCL/CAN1_RX) 96(PB9/SPI2_NSS/I2S2_WS/TIM4_CH4/TIM11_CH1/SDIO_D5/DCMI_D7/I2C1_SDA/CAN1_TX) 97(PE0/TIM4_ETR/FSMC_NBL0/DCMI_D2) 98(PE1/FSMC_NBL1/DCMI_D3)

### Notes on the sheet
- (in symbol Res 0603 1k5) 1k5
- (in symbol Res 0603 10k) 10K

### Library data of the parts
C14-C18 C26-C30 = Cap 0603 22pF: 22 pF ±5% 50V Ceramic Capacitor C0G, NP0 0603 (1608 Metric); Manufacturer_Name: KEMET; Manufacturer_Part_Number: CC0603JRNPO9BN220; Datasheet Link: http://componentsearchengine.com/Datasheets/1/CC0603JRNPO9BN220.pdf; Mouser Part Number: 603-CC603JRNPO9BN220; Mouser Price/Stock: https://www.mouser.co.uk/ProductDetail/YAGEO/CC0603JRNPO9BN220?qs=vTakOoo5QyIVMYOUTI%2F4zA%3D%3D; Arrow Part Number: CC0603JRNPO9BN220; Arrow Price/Stock: https://www.arrow.com/en/products/cc0603jrnpo9bn220/yageo?region=nac
C19-C24 C31-C34 = Cap 106 - 0603: as C1 on sheet Power; Datasheet Link: https://psearch.en.murata.com/capacitor/product/GRM188D71A106KA73%23.html; Height: 0.9mm; Mouser Part Number: 81-GRM188D71A106KA3D; Mouser Price/Stock: https://www.mouser.co.uk/ProductDetail/Murata-Electronics/GRM188D71A106KA73D?qs=FvQ4nYu%252B2He2GIhYKxXmMQ%3D%3D; Arrow Part Number: GRM188D71A106KA73D; Arrow Price/Stock: https://www.arrow.com/en/products/grm188d71a106ka73d/murata-manufacturing?region=nac
C25 C35 = Cap 103 - 0603: as C2 on sheet Power; Datasheet Link: https://datasheet.datasheetarchive.com/originals/distributors/Datasheets_SAMA/d9f127a4875522309d99aa7dec79633c.pdf; Height: 0.9mm; Mouser Part Number: 603-CC603KRX7R9BB103; Mouser Price/Stock: https://www.mouser.co.uk/ProductDetail/YAGEO/CC0603KRX7R9BB103?qs=AgBp2OyFlx%252BeoRRspw6PJg%3D%3D; Arrow Part Number: CC0603KRX7R9BB103; Arrow Price/Stock: https://www.arrow.com/en/products/cc0603krx7r9bb103/yageo?region=nac
IC3 = STM32F103C8T6TR: Manufacturer_Name: STMicroelectronics; Datasheet Link: http://media.digikey.com/pdf/Data%20Sheets/ST%20Microelectronics%20PDFS/STM32F103x8,B.pdf; Height: 1.6mm; Manufacturer_Part_Number: STM32F103C8T6TR; Mouser Part Number: 511-STM32F103C8T6TR; Mouser Price/Stock: https://www.mouser.co.uk/ProductDetail/STMicroelectronics/STM32F103C8T6TR?qs=5HwTSiuA5HDxFj62n06yag%3D%3D; Arrow Part Number: STM32F103C8T6TR; Arrow Price/Stock: https://www.arrow.com/en/products/stm32f103c8t6tr/stmicroelectronics?region=nac
J2 J3 = JTAG 5 pin: Headers & Wire Housings 5P HEADER 15u Au; Manufacturer_Name: Molex; Datasheet Link: https://www.mouser.com/datasheet/2/276/0022284054_PCB_HEADERS-228201.pdf; Height: 10.67mm; Manufacturer_Part_Number: 22-28-4054; Mouser Part Number: 538-22-28-4054; Mouser Price/Stock: https://www.mouser.com/Search/Refine.aspx?Keyword=538-22-28-4054
LED2-LED12 = LED0603_BLUE: as LED1 on sheet Power; Datasheet Link: https://componentsearchengine.com/Datasheets/2/150060BS75000.pdf; Height: 0.8mm; Mouser Part Number: 710-150060BS75000; Mouser Price/Stock: https://www.mouser.co.uk/ProductDetail/Wurth-Elektronik/150060BS75000?qs=LlUlMxKIyB2DLLpXQThavA%3D%3D
R4-R7 R9 R11 R14 R16 R19 R20 R31 = Res 0603 1k5: Thick Film Resistors - SMD 1.5 kOhms 100mW 0603 1%; Manufacturer_Name: KEMET; Manufacturer_Part_Number: RC0603FR-071K5L; Datasheet Link: http://www.yageo.com/documents/recent/PYu-RC0603_51_RoHS_L_v5.pdf; Height: 0.55mm; Mouser Part Number: 603-RC0603FR-071K5L; Mouser Price/Stock: https://www.mouser.co.uk/ProductDetail/YAGEO/RC0603FR-071K5L?qs=VU8sRB4EgwBMt9nc4XGNgA%3D%3D; Arrow Part Number: RC0603FR-071K5L; Arrow Price/Stock: https://www.arrow.com/en/products/rc0603fr-071k5l/yageo?region=nac
R8 R10 R12 R13 R15 R17 R18 R22-R30 R32 = Res 0603 10k: as R2 on sheet Power; Datasheet Link: http://industrial.panasonic.com/cdbs/www-data/pdf/RDA0000/AOA0000C86.pdf; Height: 0.55mm; Mouser Part Number: 667-ERJ-3EKF1002V; Mouser Price/Stock: https://www.mouser.co.uk/ProductDetail/Panasonic/ERJ-3EKF1002V?qs=H7k1u0Mp9JSrGPQ5%2F5COuw%3D%3D; Arrow Part Number: ERJ-3EKF1002V; Arrow Price/Stock: https://www.arrow.com/en/products/erj-3ekf1002v/panasonic?region=europe
SW1-SW4 = Switch SMD 2 pin: SWITCH TACTILE SPST-NO 0.05A 12V; Manufacturer_Name: C & K COMPONENTS; Manufacturer_Part_Number: RS-282G05A3-SM RT; Datasheet Link: https://media.digikey.com/pdf/Data%20Sheets/C&K/RS-282G05A-SM_RT.pdf; Height: 2.5mm; Mouser Part Number: 611-RS-282G05A3-SMRT; Mouser Price/Stock: https://www.mouser.com/Search/ProductDetail.aspx?qs=T%252bgPUmif8%252bjtyA9QuPnoeg%3d%3d
U3 = STM32F407VET6: Manufacturer_Name: STMicroelectronics; Datasheet Link: http://www.st.com/web/en/resource/technical/document/datasheet/DM00037051.pdf; Height: 1.6mm; Manufacturer_Part_Number: STM32F407VET6; Mouser Part Number: 511-STM32F407VET6; Mouser Price/Stock: https://www.mouser.co.uk/ProductDetail/STMicroelectronics/STM32F407VET6?qs=Z8%252BeY1k3TIJFAMMqSR%252BGtw%3D%3D; Arrow Part Number: STM32F407VET6; Arrow Price/Stock: https://www.arrow.com/en/products/stm32f407vet6/stmicroelectronics?region=nac
Y1 Y2 = XTAL 8MHz: Crystal 8Mhz SMD 5032 2 pin; Manufacturer_Name: Diodes Incorporated; Datasheet Link: https://media.digikey.com/pdf/Data%20Sheets/Pericom%20PDFs/F90800018Q_A.pdf; Height: 1.35mm; Manufacturer_Part_Number: F90800018Q; Mouser Part Number: 729-F90800018Q; Mouser Price/Stock: https://www.mouser.com/Search/Refine.aspx?Keyword=729-F90800018Q; Arrow Part Number: F90800018Q; Arrow Price/Stock: https://www.arrow.com/en/products/f90800018q/diodes-incorporated

## Sheet Digital In-Out.SchDoc
size A2
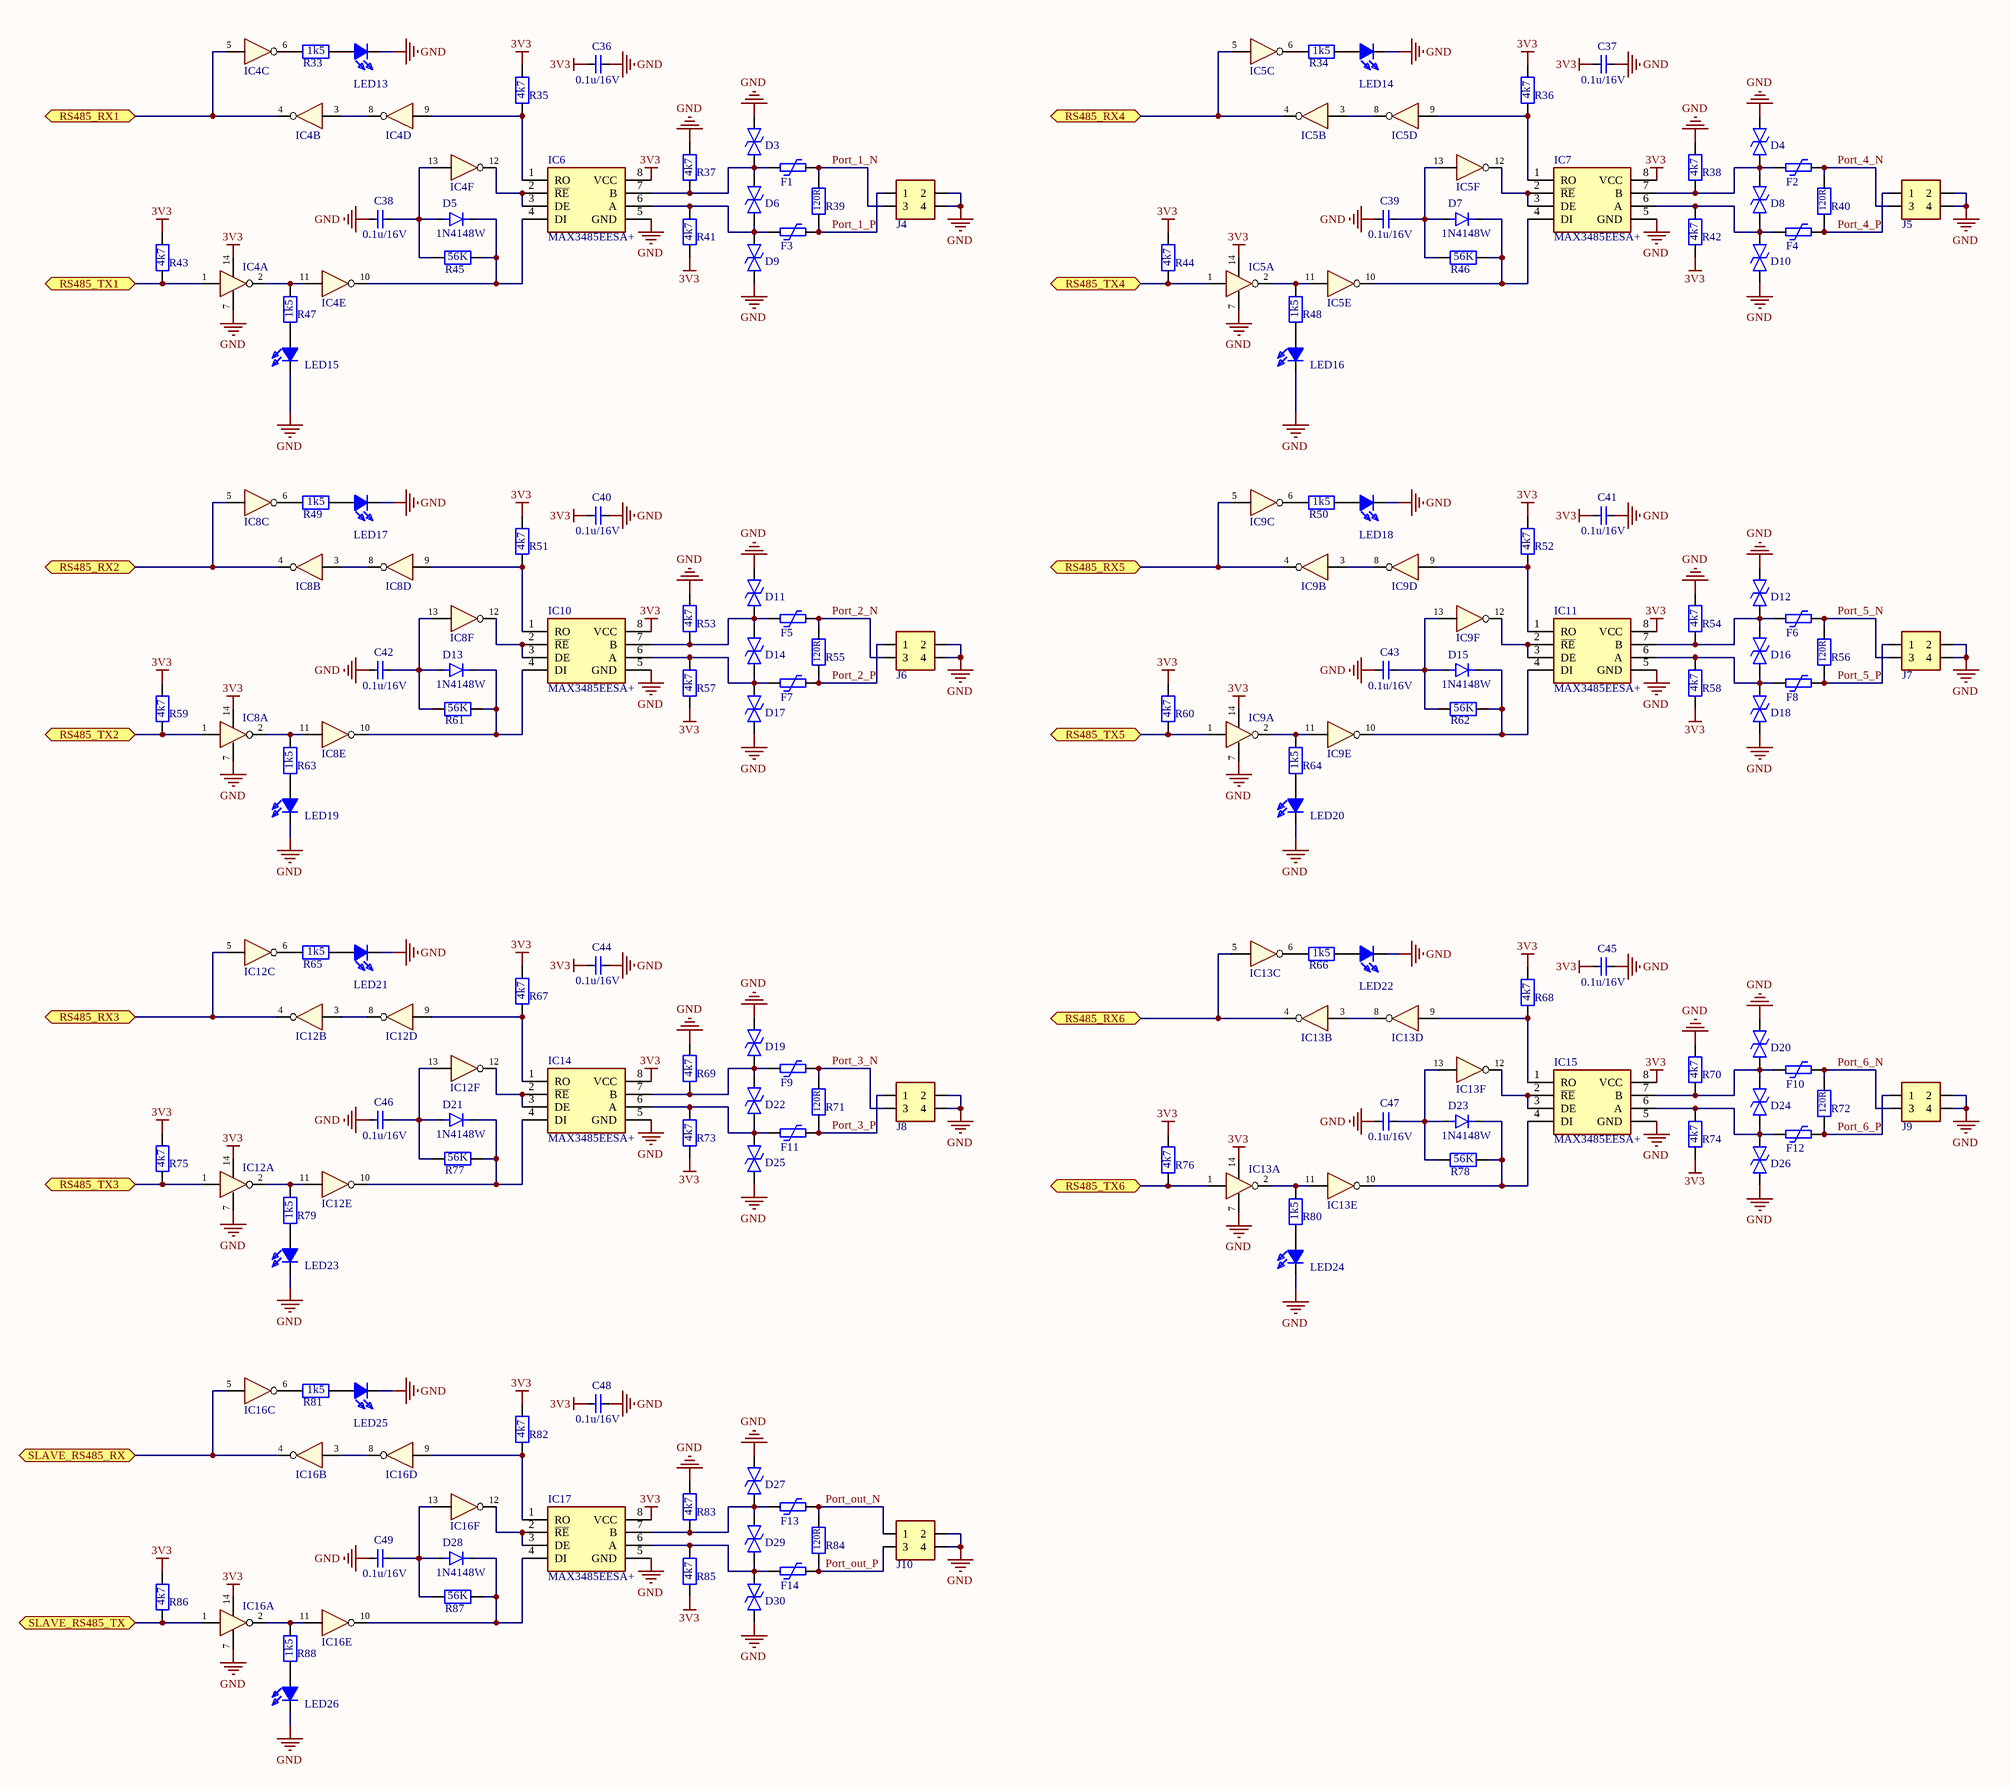
[diagram p2: Digital In-Out.SchDoc]

### Parts
C36  0.1u/16V  [CAPC1608X95N]
C37  0.1u/16V  [CAPC1608X95N]
C38  0.1u/16V  [CAPC1608X95N]
C39  0.1u/16V  [CAPC1608X95N]
C40  0.1u/16V  [CAPC1608X95N]
C41  0.1u/16V  [CAPC1608X95N]
C42  0.1u/16V  [CAPC1608X95N]
C43  0.1u/16V  [CAPC1608X95N]
C44  0.1u/16V  [CAPC1608X95N]
C45  0.1u/16V  [CAPC1608X95N]
C46  0.1u/16V  [CAPC1608X95N]
C47  0.1u/16V  [CAPC1608X95N]
C48  0.1u/16V  [CAPC1608X95N]
C49  0.1u/16V  [CAPC1608X95N]
D3  SMAJ6.8CA  [DIOM5226X247N]  (value not drawn)
D4  SMAJ6.8CA  [DIOM5226X247N]  (value not drawn)
D5  1N4148W  [SOD3716X135N]
D6  SMAJ6.8CA  [DIOM5226X247N]  (value not drawn)
D7  1N4148W  [SOD3716X135N]
D8  SMAJ6.8CA  [DIOM5226X247N]  (value not drawn)
D9  SMAJ6.8CA  [DIOM5226X247N]  (value not drawn)
D10  SMAJ6.8CA  [DIOM5226X247N]  (value not drawn)
D11  SMAJ6.8CA  [DIOM5226X247N]  (value not drawn)
D12  SMAJ6.8CA  [DIOM5226X247N]  (value not drawn)
D13  1N4148W  [SOD3716X135N]
D14  SMAJ6.8CA  [DIOM5226X247N]  (value not drawn)
D15  1N4148W  [SOD3716X135N]
D16  SMAJ6.8CA  [DIOM5226X247N]  (value not drawn)
D17  SMAJ6.8CA  [DIOM5226X247N]  (value not drawn)
D18  SMAJ6.8CA  [DIOM5226X247N]  (value not drawn)
D19  SMAJ6.8CA  [DIOM5226X247N]  (value not drawn)
D20  SMAJ6.8CA  [DIOM5226X247N]  (value not drawn)
D21  1N4148W  [SOD3716X135N]
D22  SMAJ6.8CA  [DIOM5226X247N]  (value not drawn)
D23  1N4148W  [SOD3716X135N]
D24  SMAJ6.8CA  [DIOM5226X247N]  (value not drawn)
D25  SMAJ6.8CA  [DIOM5226X247N]  (value not drawn)
D26  SMAJ6.8CA  [DIOM5226X247N]  (value not drawn)
D27  SMAJ6.8CA  [DIOM5226X247N]  (value not drawn)
D28  1N4148W  [SOD3716X135N]
D29  SMAJ6.8CA  [DIOM5226X247N]  (value not drawn)
D30  SMAJ6.8CA  [DIOM5226X247N]  (value not drawn)
F1  USHT020KX  [MFUSHT020KX362]  (value not drawn)
F2  USHT020KX  [MFUSHT020KX362]  (value not drawn)
F3  USHT020KX  [MFUSHT020KX362]  (value not drawn)
F4  USHT020KX  [MFUSHT020KX362]  (value not drawn)
F5  USHT020KX  [MFUSHT020KX362]  (value not drawn)
F6  USHT020KX  [MFUSHT020KX362]  (value not drawn)
F7  USHT020KX  [MFUSHT020KX362]  (value not drawn)
F8  USHT020KX  [MFUSHT020KX362]  (value not drawn)
F9  USHT020KX  [MFUSHT020KX362]  (value not drawn)
F10  USHT020KX  [MFUSHT020KX362]  (value not drawn)
F11  USHT020KX  [MFUSHT020KX362]  (value not drawn)
F12  USHT020KX  [MFUSHT020KX362]  (value not drawn)
F13  USHT020KX  [MFUSHT020KX362]  (value not drawn)
F14  USHT020KX  [MFUSHT020KX362]  (value not drawn)
IC4  nverters Hex A 595-CD4069UBMT  [SOIC127P600X175-14N]  (value not drawn)  (parts A,B,C,D,E,F of 6)
IC5  nverters Hex A 595-CD4069UBMT  [SOIC127P600X175-14N]  (value not drawn)  (parts A,B,C,D,E,F of 6)
IC6  MAX3485EESA+  [SOIC127P600X175-8N]
IC7  MAX3485EESA+  [SOIC127P600X175-8N]
IC8  nverters Hex A 595-CD4069UBMT  [SOIC127P600X175-14N]  (value not drawn)  (parts A,B,C,D,E,F of 6)
IC9  nverters Hex A 595-CD4069UBMT  [SOIC127P600X175-14N]  (value not drawn)  (parts A,B,C,D,E,F of 6)
IC10  MAX3485EESA+  [SOIC127P600X175-8N]
IC11  MAX3485EESA+  [SOIC127P600X175-8N]
IC12  nverters Hex A 595-CD4069UBMT  [SOIC127P600X175-14N]  (value not drawn)  (parts A,B,C,D,E,F of 6)
IC13  nverters Hex A 595-CD4069UBMT  [SOIC127P600X175-14N]  (value not drawn)  (parts A,B,C,D,E,F of 6)
IC14  MAX3485EESA+  [SOIC127P600X175-8N]
IC15  MAX3485EESA+  [SOIC127P600X175-8N]
IC16  nverters Hex A 595-CD4069UBMT  [SOIC127P600X175-14N]  (value not drawn)  (parts A,B,C,D,E,F of 6)
IC17  MAX3485EESA+  [SOIC127P600X175-8N]
J4  Connector THD 4 position 0.165" (4.20mm)  [RHDR4W125P550X420_2X2_960X960X1310P]  (value not drawn)
J5  Connector THD 4 position 0.165" (4.20mm)  [RHDR4W125P550X420_2X2_960X960X1310P]  (value not drawn)
J6  Connector THD 4 position 0.165" (4.20mm)  [RHDR4W125P550X420_2X2_960X960X1310P]  (value not drawn)
J7  Connector THD 4 position 0.165" (4.20mm)  [RHDR4W125P550X420_2X2_960X960X1310P]  (value not drawn)
J8  Connector THD 4 position 0.165" (4.20mm)  [RHDR4W125P550X420_2X2_960X960X1310P]  (value not drawn)
J9  Connector THD 4 position 0.165" (4.20mm)  [RHDR4W125P550X420_2X2_960X960X1310P]  (value not drawn)
J10  Connector THD 4 position 0.165" (4.20mm)  [RHDR4W125P550X420_2X2_960X960X1310P]  (value not drawn)
LED13  LED0603_BLUE  [LEDC1608X80N]  (value not drawn)
LED14  LED0603_BLUE  [LEDC1608X80N]  (value not drawn)
LED15  LED0603_BLUE  [LEDC1608X80N]  (value not drawn)
LED16  LED0603_BLUE  [LEDC1608X80N]  (value not drawn)
LED17  LED0603_BLUE  [LEDC1608X80N]  (value not drawn)
LED18  LED0603_BLUE  [LEDC1608X80N]  (value not drawn)
LED19  LED0603_BLUE  [LEDC1608X80N]  (value not drawn)
LED20  LED0603_BLUE  [LEDC1608X80N]  (value not drawn)
LED21  LED0603_BLUE  [LEDC1608X80N]  (value not drawn)
LED22  LED0603_BLUE  [LEDC1608X80N]  (value not drawn)
LED23  LED0603_BLUE  [LEDC1608X80N]  (value not drawn)
LED24  LED0603_BLUE  [LEDC1608X80N]  (value not drawn)
LED25  LED0603_BLUE  [LEDC1608X80N]  (value not drawn)
LED26  LED0603_BLUE  [LEDC1608X80N]  (value not drawn)
R33  Res 0603 1k5  [RESC1608X55N]  (value not drawn)
R34  Res 0603 1k5  [RESC1608X55N]  (value not drawn)
R35  Res 0603 4k7  [RESC1608X55N]  (value not drawn)
R36  Res 0603 4k7  [RESC1608X55N]  (value not drawn)
R37  Res 0603 4k7  [RESC1608X55N]  (value not drawn)
R38  Res 0603 4k7  [RESC1608X55N]  (value not drawn)
R39  120R  [RESC1608X55N]  (value not drawn)
R40  120R  [RESC1608X55N]  (value not drawn)
R41  Res 0603 4k7  [RESC1608X55N]  (value not drawn)
R42  Res 0603 4k7  [RESC1608X55N]  (value not drawn)
R43  Res 0603 4k7  [RESC1608X55N]  (value not drawn)
R44  Res 0603 4k7  [RESC1608X55N]  (value not drawn)
R45  56k  [RESC1608X55N]  (value not drawn)
R46  56k  [RESC1608X55N]  (value not drawn)
R47  Res 0603 1k5  [RESC1608X55N]  (value not drawn)
R48  Res 0603 1k5  [RESC1608X55N]  (value not drawn)
R49  Res 0603 1k5  [RESC1608X55N]  (value not drawn)
R50  Res 0603 1k5  [RESC1608X55N]  (value not drawn)
R51  Res 0603 4k7  [RESC1608X55N]  (value not drawn)
R52  Res 0603 4k7  [RESC1608X55N]  (value not drawn)
R53  Res 0603 4k7  [RESC1608X55N]  (value not drawn)
R54  Res 0603 4k7  [RESC1608X55N]  (value not drawn)
R55  120R  [RESC1608X55N]  (value not drawn)
R56  120R  [RESC1608X55N]  (value not drawn)
R57  Res 0603 4k7  [RESC1608X55N]  (value not drawn)
R58  Res 0603 4k7  [RESC1608X55N]  (value not drawn)
R59  Res 0603 4k7  [RESC1608X55N]  (value not drawn)
R60  Res 0603 4k7  [RESC1608X55N]  (value not drawn)
R61  56k  [RESC1608X55N]  (value not drawn)
R62  56k  [RESC1608X55N]  (value not drawn)
R63  Res 0603 1k5  [RESC1608X55N]  (value not drawn)
R64  Res 0603 1k5  [RESC1608X55N]  (value not drawn)
R65  Res 0603 1k5  [RESC1608X55N]  (value not drawn)
R66  Res 0603 1k5  [RESC1608X55N]  (value not drawn)
R67  Res 0603 4k7  [RESC1608X55N]  (value not drawn)
R68  Res 0603 4k7  [RESC1608X55N]  (value not drawn)
R69  Res 0603 4k7  [RESC1608X55N]  (value not drawn)
R70  Res 0603 4k7  [RESC1608X55N]  (value not drawn)
R71  120R  [RESC1608X55N]  (value not drawn)
R72  120R  [RESC1608X55N]  (value not drawn)
R73  Res 0603 4k7  [RESC1608X55N]  (value not drawn)
R74  Res 0603 4k7  [RESC1608X55N]  (value not drawn)
R75  Res 0603 4k7  [RESC1608X55N]  (value not drawn)
R76  Res 0603 4k7  [RESC1608X55N]  (value not drawn)
R77  56k  [RESC1608X55N]  (value not drawn)
R78  56k  [RESC1608X55N]  (value not drawn)
R79  Res 0603 1k5  [RESC1608X55N]  (value not drawn)
R80  Res 0603 1k5  [RESC1608X55N]  (value not drawn)
R81  Res 0603 1k5  [RESC1608X55N]  (value not drawn)
R82  Res 0603 4k7  [RESC1608X55N]  (value not drawn)
R83  Res 0603 4k7  [RESC1608X55N]  (value not drawn)
R84  120R  [RESC1608X55N]  (value not drawn)
R85  Res 0603 4k7  [RESC1608X55N]  (value not drawn)
R86  Res 0603 4k7  [RESC1608X55N]  (value not drawn)
R87  56k  [RESC1608X55N]  (value not drawn)
R88  Res 0603 1k5  [RESC1608X55N]  (value not drawn)

### Ports
RS485_RX1 (bidir), RS485_RX2 (bidir), RS485_RX3 (bidir), RS485_RX4 (bidir), RS485_RX5 (bidir), RS485_RX6 (bidir), RS485_TX1 (bidir), RS485_TX2 (bidir), RS485_TX3 (bidir), RS485_TX4 (bidir), RS485_TX5 (bidir), RS485_TX6 (bidir), SLAVE_RS485_RX (bidir), SLAVE_RS485_TX (bidir)

### Nets
3V3: C36.1 C37.1 C40.1 C41.1 C44.1 C45.1 C48.1 IC4.14(VDD) IC5.14(VDD) IC6.8(VCC) IC7.8(VCC) IC8.14(VDD) IC9.14(VDD) IC10.8(VCC) IC11.8(VCC) IC12.14(VDD) IC13.14(VDD) IC14.8(VCC) IC15.8(VCC) IC16.14(VDD) IC17.8(VCC) R35.2 R36.2 R41.1 R42.1 R43.2 R44.2 R51.2 R52.2 R57.1 R58.1 R59.2 R60.2 R67.2 R68.2 R73.1 R74.1 R75.2 R76.2 R82.2 R85.1 R86.2
GND: C36.2 C37.2 C38.1 C39.1 C40.2 C41.2 C42.1 C43.1 C44.2 C45.2 C46.1 C47.1 C48.2 C49.1 D3.2 D4.2 D9.1 D10.1 D11.2 D12.2 D17.1 D18.1 D19.2 D20.2 D25.1 D26.1 D27.2 D30.1 IC4.7(VSS) IC5.7(VSS) IC6.5(GND) IC7.5(GND) IC8.7(VSS) IC9.7(VSS) IC10.5(GND) IC11.5(GND) IC12.7(VSS) IC13.7(VSS) IC14.5(GND) IC15.5(GND) IC16.7(VSS) IC17.5(GND) J4.2 J4.4 J5.2 J5.4 J6.2 J6.4 J7.2 J7.4 J8.2 J8.4 J9.2 J9.4 J10.2 J10.4 LED13.1(K) LED14.1(K) LED15.1(K) LED16.1(K) LED17.1(K) LED18.1(K) LED19.1(K) LED20.1(K) LED21.1(K) LED22.1(K) LED23.1(K) LED24.1(K) LED25.1(K) LED26.1(K) R37.2 R38.2 R53.2 R54.2 R69.2 R70.2 R83.2
Port_1_N: F1.2 J4.3 R39.2
Port_1_P: F3.2 J4.1 R39.1
Port_2_N: F5.2 J6.3 R55.2
Port_2_P: F7.2 J6.1 R55.1
Port_3_N: F9.2 J8.3 R71.2
Port_3_P: F11.2 J8.1 R71.1
Port_4_N: F2.2 J5.3 R40.2
Port_4_P: F4.2 J5.1 R40.1
Port_5_N: F6.2 J7.3 R56.2
Port_5_P: F8.2 J7.1 R56.1
Port_6_N: F10.2 J9.3 R72.2
Port_6_P: F12.2 J9.1 R72.1
Port_out_N: F13.2 J10.1 R84.2
Port_out_P: F14.2 J10.3 R84.1
RS485_RX1: IC4.4(H=~{B}) IC4.5(C) ; port RS485_RX1
RS485_RX2: IC8.4(H=~{B}) IC8.5(C) ; port RS485_RX2
RS485_RX3: IC12.4(H=~{B}) IC12.5(C) ; port RS485_RX3
RS485_RX4: IC5.4(H=~{B}) IC5.5(C) ; port RS485_RX4
RS485_RX5: IC9.4(H=~{B}) IC9.5(C) ; port RS485_RX5
RS485_RX6: IC13.4(H=~{B}) IC13.5(C) ; port RS485_RX6
RS485_TX1: IC4.1(A) R43.1 ; port RS485_TX1
RS485_TX2: IC8.1(A) R59.1 ; port RS485_TX2
RS485_TX3: IC12.1(A) R75.1 ; port RS485_TX3
RS485_TX4: IC5.1(A) R44.1 ; port RS485_TX4
RS485_TX5: IC9.1(A) R60.1 ; port RS485_TX5
RS485_TX6: IC13.1(A) R76.1 ; port RS485_TX6
SLAVE_RX1: IC16.4(H=~{B}) IC16.5(C) ; port SLAVE_RS485_RX
SLAVE_TX1: IC16.1(A) R86.1 ; port SLAVE_RS485_TX
NetC38_2: C38.2 D5.2(A) IC4.13(F) R45.1
NetC39_2: C39.2 D7.2(A) IC5.13(F) R46.1
NetC42_2: C42.2 D13.2(A) IC8.13(F) R61.1
NetC43_2: C43.2 D15.2(A) IC9.13(F) R62.1
NetC46_2: C46.2 D21.2(A) IC12.13(F) R77.1
NetC47_2: C47.2 D23.2(A) IC13.13(F) R78.1
NetC49_2: C49.2 D28.2(A) IC16.13(F) R87.1
NetD3_1: D3.1 D6.2 F1.1 IC6.7(B) R37.1
NetD4_1: D4.1 D8.2 F2.1 IC7.7(B) R38.1
NetD5_1: D5.1(K) IC4.10(K=~{E}) IC6.4(DI) R45.2
NetD6_1: D6.1 D9.2 F3.1 IC6.6(A) R41.2
NetD7_1: D7.1(K) IC5.10(K=~{E}) IC7.4(DI) R46.2
NetD8_1: D8.1 D10.2 F4.1 IC7.6(A) R42.2
NetD11_1: D11.1 D14.2 F5.1 IC10.7(B) R53.1
NetD12_1: D12.1 D16.2 F6.1 IC11.7(B) R54.1
NetD13_1: D13.1(K) IC8.10(K=~{E}) IC10.4(DI) R61.2
NetD14_1: D14.1 D17.2 F7.1 IC10.6(A) R57.2
NetD15_1: D15.1(K) IC9.10(K=~{E}) IC11.4(DI) R62.2
NetD16_1: D16.1 D18.2 F8.1 IC11.6(A) R58.2
NetD19_1: D19.1 D22.2 F9.1 IC14.7(B) R69.1
NetD20_1: D20.1 D24.2 F10.1 IC15.7(B) R70.1
NetD21_1: D21.1(K) IC12.10(K=~{E}) IC14.4(DI) R77.2
NetD22_1: D22.1 D25.2 F11.1 IC14.6(A) R73.2
NetD23_1: D23.1(K) IC13.10(K=~{E}) IC15.4(DI) R78.2
NetD24_1: D24.1 D26.2 F12.1 IC15.6(A) R74.2
NetD27_1: D27.1 D29.2 F13.1 IC17.7(B) R83.1
NetD28_1: D28.1(K) IC16.10(K=~{E}) IC17.4(DI) R87.2
NetD29_1: D29.1 D30.2 F14.1 IC17.6(A) R85.2
NetIC4_2: IC4.2(G=~{A}) IC4.11(E) R47.2
NetIC4_3: IC4.3(B) IC4.8(J=~{D})
NetIC4_6: IC4.6(I=~{C}) R33.1
NetIC4_9: IC4.9(D) IC6.1(RO) R35.1
NetIC4_12: IC4.12(L=~{F}) IC6.2(~{RE}) IC6.3(DE)
NetIC5_2: IC5.2(G=~{A}) IC5.11(E) R48.2
NetIC5_3: IC5.3(B) IC5.8(J=~{D})
NetIC5_6: IC5.6(I=~{C}) R34.1
NetIC5_9: IC5.9(D) IC7.1(RO) R36.1
NetIC5_12: IC5.12(L=~{F}) IC7.2(~{RE}) IC7.3(DE)
NetIC8_2: IC8.2(G=~{A}) IC8.11(E) R63.2
NetIC8_3: IC8.3(B) IC8.8(J=~{D})
NetIC8_6: IC8.6(I=~{C}) R49.1
NetIC8_9: IC8.9(D) IC10.1(RO) R51.1
NetIC8_12: IC8.12(L=~{F}) IC10.2(~{RE}) IC10.3(DE)
NetIC9_2: IC9.2(G=~{A}) IC9.11(E) R64.2
NetIC9_3: IC9.3(B) IC9.8(J=~{D})
NetIC9_6: IC9.6(I=~{C}) R50.1
NetIC9_9: IC9.9(D) IC11.1(RO) R52.1
NetIC9_12: IC9.12(L=~{F}) IC11.2(~{RE}) IC11.3(DE)
NetIC12_2: IC12.2(G=~{A}) IC12.11(E) R79.2
NetIC12_3: IC12.3(B) IC12.8(J=~{D})
NetIC12_6: IC12.6(I=~{C}) R65.1
NetIC12_9: IC12.9(D) IC14.1(RO) R67.1
NetIC12_12: IC12.12(L=~{F}) IC14.2(~{RE}) IC14.3(DE)
NetIC13_2: IC13.2(G=~{A}) IC13.11(E) R80.2
NetIC13_3: IC13.3(B) IC13.8(J=~{D})
NetIC13_6: IC13.6(I=~{C}) R66.1
NetIC13_9: IC13.9(D) IC15.1(RO) R68.1
NetIC13_12: IC13.12(L=~{F}) IC15.2(~{RE}) IC15.3(DE)
NetIC16_2: IC16.2(G=~{A}) IC16.11(E) R88.2
NetIC16_3: IC16.3(B) IC16.8(J=~{D})
NetIC16_6: IC16.6(I=~{C}) R81.1
NetIC16_9: IC16.9(D) IC17.1(RO) R82.1
NetIC16_12: IC16.12(L=~{F}) IC17.2(~{RE}) IC17.3(DE)
NetLED13_2: LED13.2(A) R33.2
NetLED14_2: LED14.2(A) R34.2
NetLED15_2: LED15.2(A) R47.1
NetLED16_2: LED16.2(A) R48.1
NetLED17_2: LED17.2(A) R49.2
NetLED18_2: LED18.2(A) R50.2
NetLED19_2: LED19.2(A) R63.1
NetLED20_2: LED20.2(A) R64.1
NetLED21_2: LED21.2(A) R65.2
NetLED22_2: LED22.2(A) R66.2
NetLED23_2: LED23.2(A) R79.1
NetLED24_2: LED24.2(A) R80.1
NetLED25_2: LED25.2(A) R81.2
NetLED26_2: LED26.2(A) R88.1

### Notes on the sheet
- (in symbol Res 0603 1k5) 1k5
- (in symbol Res 0603 4k7) 4k7
- (in symbol Res 0603 56k) 56K

### Library data of the parts
C36-C49 = Cap 0603 0.1u/16V: Multilayer Ceramic Capacitors MLCC - SMD/SMT 16V 100pF C0G 0603 1%; Manufacturer_Name: KEMET; Manufacturer_Part_Number: C0603C101F4GAC; Datasheet Link: https://content.kemet.com/datasheets/KEM_C1003_C0G_SMD.pdf; Height: 0.87mm; Mouser Part Number: 80-C0603C101F4G; Mouser Price/Stock: https://www.mouser.com/Search/Refine.aspx?Keyword=80-C0603C101F4G
D3 D4 D6 D8-D12 D14 D16-D20 D22 D24-D27 D29 D30 = SMAJ6.8CA: TVS Diode (Bi-directional) - 400W 10.5V 38.1A 5.8V 6.45VSMA(D; Manufacturer_Name: Vishay; Datasheet Link: https://www.kynix.com/Detail/311145/SMAJ6.8CA.html; Height: 2.47mm; Manufacturer_Part_Number: SMAJ6.8CA
D5 D7 D13 D15 D21 D23 D28 = 1N4148W: Diode; Manufacturer_Name: Vishay; Manufacturer_Part_Number: 1N4148W-E3-08; Datasheet Link: http://www.vishay.com/docs/85748/1n4148w.pdf; Height: 1.35mm; Mouser Part Number: 78-1N4148W-E3-08; Mouser Price/Stock: https://www.mouser.co.uk/ProductDetail/Vishay-Semiconductors/1N4148W-E3-08?qs=bTzheeSci6TVjpxfjjRVMw%3D%3D; Arrow Part Number: 1N4148W-E3-08; Arrow Price/Stock: https://www.arrow.com/en/products/1n4148w-e3-08/vishay?region=europe
F1-F14 = USHT020KX: Resettable Fuses - PPTC 1210 High Temp SMD Polymer PTC 0.20A/36V; Manufacturer_Name: Bourns; Manufacturer_Part_Number: MF-USHT020KX/36-2; Datasheet Link: https://www.bourns.com/docs/product-datasheets/mf-usht.pdf; Height: 0.85mm; Mouser Part Number: 652-MF-USHT020KX/36; Mouser Price/Stock: https://www.mouser.co.uk/ProductDetail/Bourns/MF-USHT020KX-36-2?qs=7%2F6SraaimPQhNMgY%2F2x66A%3D%3D
IC4 IC5 IC8 IC9 IC12 IC13 IC16 = CD4069UBM: Inverters Hex A 595-CD4069UBMT; Manufacturer_Name: Texas Instruments; Datasheet Link: http://www.ti.com/lit/gpn/cd4069ub; Height: 1.75mm; Manufacturer_Part_Number: CD4069UBM; Mouser Part Number: 595-CD4069UBM; Mouser Price/Stock: https://www.mouser.co.uk/ProductDetail/Texas-Instruments/CD4069UBM?qs=gqbMQSs93zMh7cPmoolhRg%3D%3D; Arrow Part Number: CD4069UBM; Arrow Price/Stock: https://www.arrow.com/en/products/cd4069ubm/texas-instruments?region=nac
IC6 IC7 IC10 IC11 IC14 IC15 IC17 = MAX3485EESA+: Integrated Circuit; Manufacturer_Name: Analog Devices; Datasheet Link: https://datasheet.datasheetarchive.com/originals/distributors/Datasheets-18/DSA-341145.pdf; Height: 1.75mm; Manufacturer_Part_Number: MAX3485EESA+; Mouser Part Number: 700-MAX3485EESA; Mouser Price/Stock: https://www.mouser.co.uk/ProductDetail/Maxim-Integrated/MAX3485EESA%2b?qs=1THa7WoU59HLsdsozrMCeQ%3D%3D; Arrow Part Number: MAX3485EESA+; Arrow Price/Stock: https://www.arrow.com/en/products/max3485eesa/maxim-integrated?region=nac
J4-J10 = Connector 2x2: as J1 on sheet Power; Datasheet Link: https://www.molex.com/pdm_docs/sd/039281043_sd.pdf; Height: 13.1mm; Mouser Part Number: N/A; Mouser Price/Stock: https://www.mouser.co.uk/ProductDetail/Molex/0039281043?qs=PBcRNPEHKsoXjYsIax3FJA%3D%3D; Arrow Part Number: 0039281043; Arrow Price/Stock: https://www.arrow.com/en/products/0039281043/molex?utm_currency=USD&region=nac
LED13-LED26 = LED0603_BLUE: as LED1 on sheet Power; Datasheet Link: https://componentsearchengine.com/Datasheets/2/150060BS75000.pdf; Height: 0.8mm; Mouser Part Number: 710-150060BS75000; Mouser Price/Stock: https://www.mouser.co.uk/ProductDetail/Wurth-Elektronik/150060BS75000?qs=LlUlMxKIyB2DLLpXQThavA%3D%3D
R33 R34 R47-R50 R63-R66 R79-R81 R88 = Res 0603 1k5: as R4 on sheet MCU; Datasheet Link: http://www.yageo.com/documents/recent/PYu-RC0603_51_RoHS_L_v5.pdf; Height: 0.55mm; Mouser Part Number: 603-RC0603FR-071K5L; Mouser Price/Stock: https://www.mouser.co.uk/ProductDetail/YAGEO/RC0603FR-071K5L?qs=VU8sRB4EgwBMt9nc4XGNgA%3D%3D; Arrow Part Number: RC0603FR-071K5L; Arrow Price/Stock: https://www.arrow.com/en/products/rc0603fr-071k5l/yageo?region=nac
R35-R38 R41-R44 R51-R54 R57-R60 R67-R70 R73-R76 R82 R83 R85 R86 = Res 0603 4k7: Thick Film Resistors - SMD 0603 4.7Kohms 0.2W 1% AEC-Q200; Manufacturer_Name: Panasonic; Manufacturer_Part_Number: ERJ-P03F4701V; Datasheet Link: http://industrial.panasonic.com/cdbs/www-data/pdf/RDA0000/AOA0000C102.pdf; Height: 0.55mm; Mouser Part Number: 667-ERJ-P03F4701V; Mouser Price/Stock: http://www.mouser.com/Search/ProductDetail.aspx?qs=18kBAoNi3c9lrldXCbY57g%3d%3d
R39 R40 R55 R56 R71 R72 R84 = Res 0603 120R: Thick Film Resistors - SMD 0603 120ohms 1% AEC-Q200; Manufacturer_Name: Panasonic; Manufacturer_Part_Number: ERJ-3EKF1200V; Datasheet Link: http://industrial.panasonic.com/cdbs/www-data/pdf/RDA0000/AOA0000C86.pdf; Height: 0.55mm; Mouser Part Number: 667-ERJ-3EKF1200V; Mouser Price/Stock: https://www.mouser.co.uk/ProductDetail/Panasonic/ERJ-3EKF1200V?qs=iBwFsHVUAOfkZ4Bj0qjBGg%3D%3D; Arrow Part Number: ERJ-3EKF1200V; Arrow Price/Stock: https://www.arrow.com/en/products/erj-3ekf1200v/panasonic?region=nac
R45 R46 R61 R62 R77 R78 R87 = Res 0603 56k: Thick Film Resistors - SMD 0603 56Kohms 1% AEC-Q200; Manufacturer_Name: Panasonic; Manufacturer_Part_Number: ERJ-3EKF5602V; Datasheet Link: http://industrial.panasonic.com/cdbs/www-data/pdf/RDA0000/AOA0000C86.pdf; Height: 0.55mm; Mouser Part Number: 667-ERJ-3EKF5602V; Mouser Price/Stock: https://www.mouser.com/Search/Refine.aspx?Keyword=667-ERJ-3EKF5602V; Arrow Part Number: ERJ-3EKF5602V; Arrow Price/Stock: https://www.arrow.com/en/products/erj-3ekf5602v/panasonic

## Nets that join several sheets
3V3: Power (C12.2 C13.1 IC2.2 IC2.4), Digital In-Out (42 pins)
3V3_MCU: Power (C9.2 C10.1 IC1.2 IC1.4), MCU (35 pins)
GND: Power (15 pins), MCU (50 pins), Digital In-Out (77 pins)
RS485_RX1: MCU (U3.69), Digital In-Out (IC4.4 IC4.5)
RS485_RX2: MCU (U3.87), Digital In-Out (IC8.4 IC8.5)
RS485_RX3: MCU (U3.56), Digital In-Out (IC12.4 IC12.5)
RS485_RX4: MCU (U3.79), Digital In-Out (IC5.4 IC5.5)
RS485_RX5: MCU (U3.83), Digital In-Out (IC9.4 IC9.5)
RS485_RX6: MCU (U3.64), Digital In-Out (IC13.4 IC13.5)
RS485_TX1: MCU (U3.68), Digital In-Out (IC4.1 R43.1)
RS485_TX2: MCU (U3.86), Digital In-Out (IC8.1 R59.1)
RS485_TX3: MCU (U3.55), Digital In-Out (IC12.1 R75.1)
RS485_TX4: MCU (U3.78), Digital In-Out (IC5.1 R44.1)
RS485_TX5: MCU (U3.80), Digital In-Out (IC9.1 R60.1)
RS485_TX6: MCU (U3.63), Digital In-Out (IC13.1 R76.1)
SLAVE_RX1: MCU (IC3.43), Digital In-Out (IC16.4 IC16.5)
SLAVE_TX1: MCU (IC3.42), Digital In-Out (IC16.1 R86.1)